# EAGLE design midi_module (EAGLE 9.0.0)

## Sheet 1 of 3
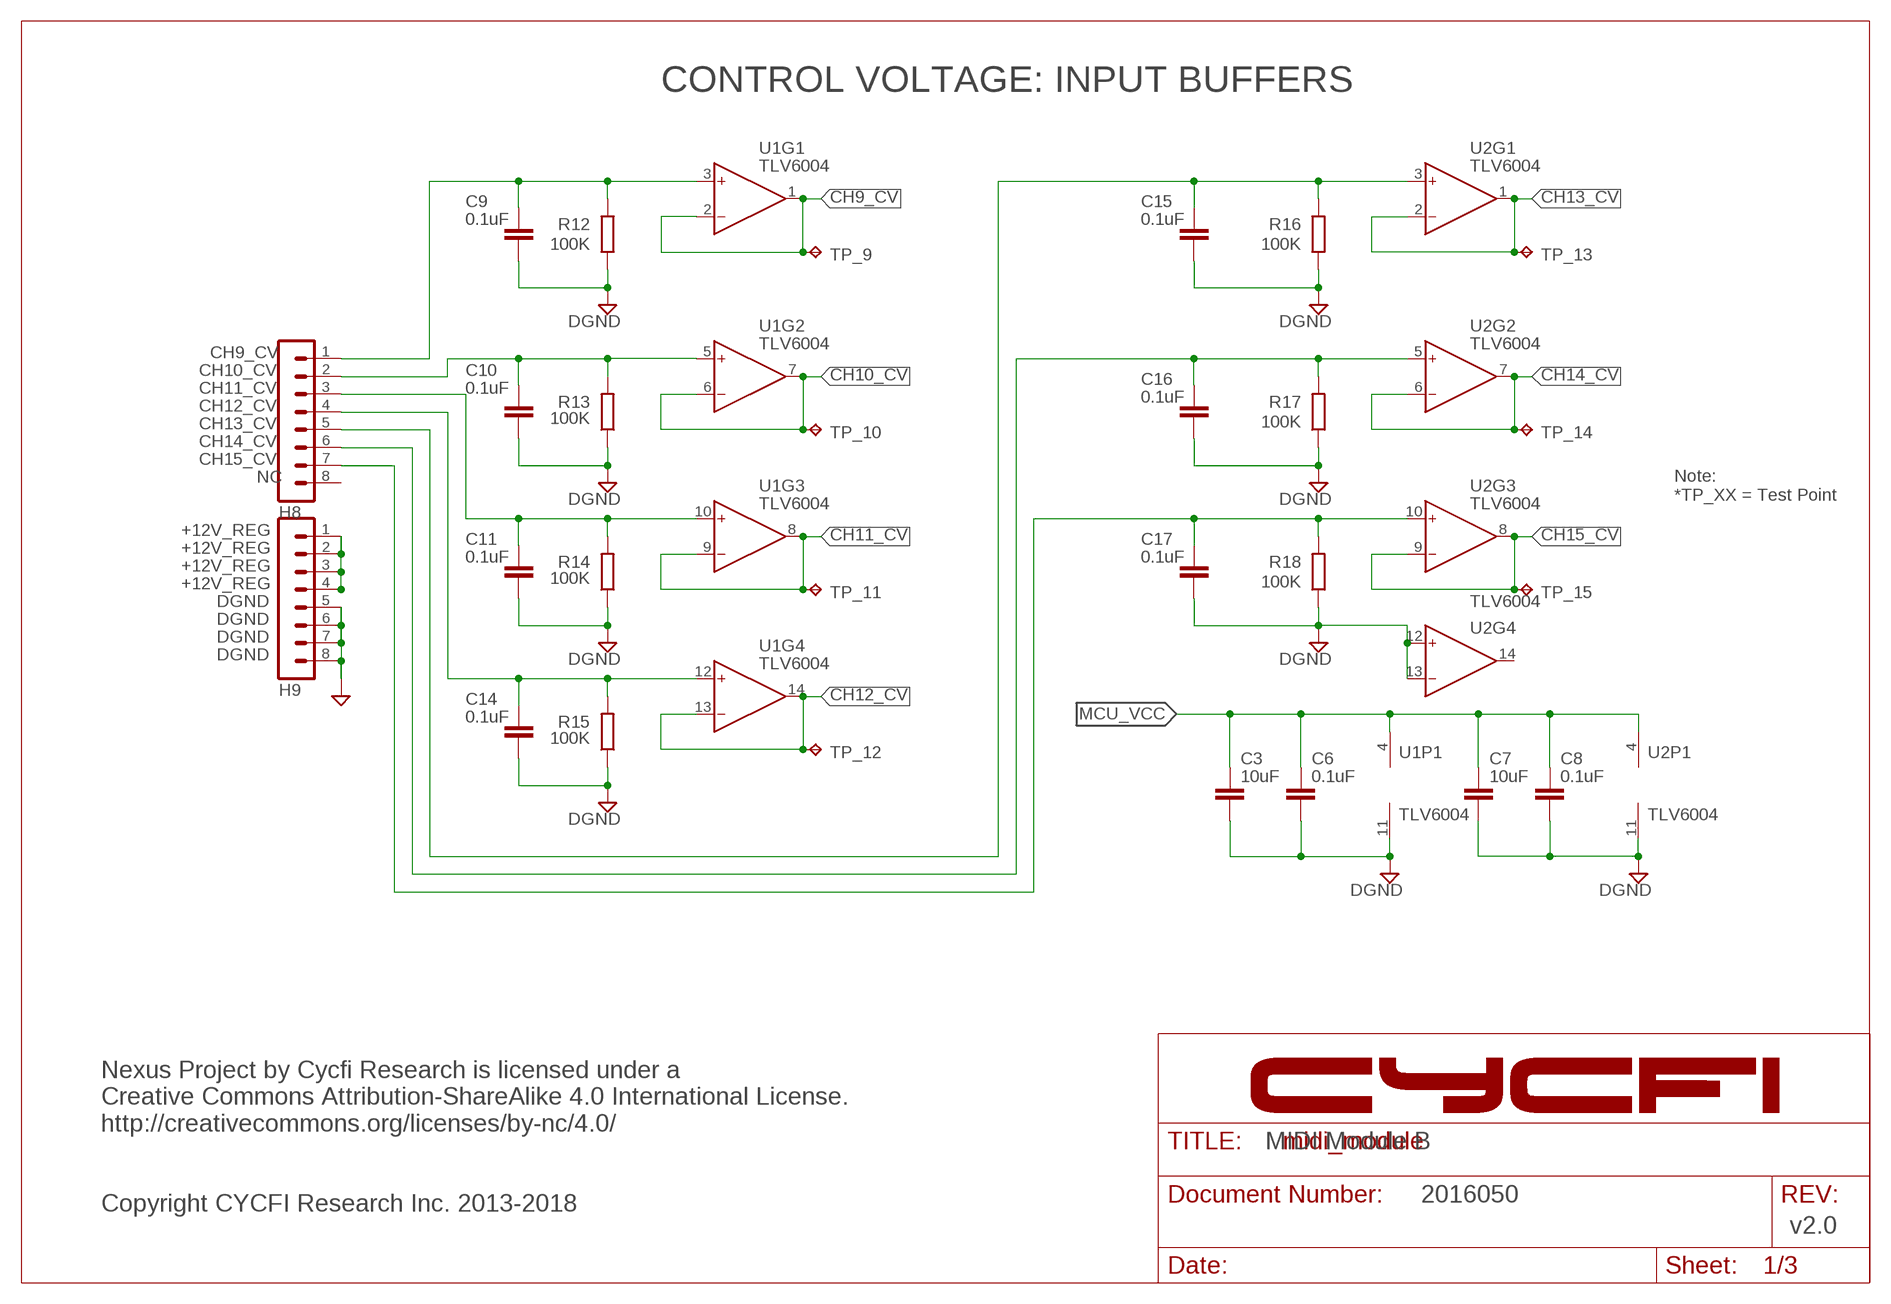
[diagram p0: schematic, sheet 1]

### Parts
C3  10uF  C-EUC0805  [C0805]
C6  0.1uF  C-EUC0603  [C0603]
C7  10uF  C-EUC0805  [C0805]
C8  0.1uF  C-EUC0603  [C0603]
C9  0.1uF  C-EUC0603  [C0603]
C10  0.1uF  C-EUC0603  [C0603]
C11  0.1uF  C-EUC0603  [C0603]
C14  0.1uF  C-EUC0603  [C0603]
C15  0.1uF  C-EUC0603  [C0603]
C16  0.1uF  C-EUC0603  [C0603]
C17  0.1uF  C-EUC0603  [C0603]
H8  MA08-1  [MA08-1]
H9  MA08-1  [MA08-1]
R12  100K  R-EU_R0402  [R0402]
R13  100K  R-EU_R0402  [R0402]
R14  100K  R-EU_R0402  [R0402]
R15  100K  R-EU_R0402  [R0402]
R16  100K  R-EU_R0402  [R0402]
R17  100K  R-EU_R0402  [R0402]
R18  100K  R-EU_R0402  [R0402]
TP_9  TPB1,27  [B1,27]
TP_10  TPB1,27  [B1,27]
TP_11  TPB1,27  [B1,27]
TP_12  TPB1,27  [B1,27]
TP_13  TPB1,27  [B1,27]
TP_14  TPB1,27  [B1,27]
TP_15  TPB1,27  [B1,27]
U1  TLV6004  [SSOP-14]
U2  TLV6004  [SSOP-14]

### Nets
+12V_REG: H9.1 H9.2 H9.3 H9.4 ; also sheet 3
CH9_CV: TP_9.TP U1.1(OUT) U1.2(IN-) ; also sheet 2
CH10_CV: TP_10.TP U1.6(IN-) U1.7(OUT) ; also sheet 2
CH11_CV: TP_11.TP U1.8(OUT) U1.9(IN-) ; also sheet 2
CH12_CV: TP_12.TP U1.13(IN-) U1.14(OUT) ; also sheet 2
CH13_CV: TP_13.TP U2.1(OUT) U2.2(IN-) ; also sheet 2
CH14_CV: TP_14.TP U2.6(IN-) U2.7(OUT) ; also sheet 2
CH15_CV: TP_15.TP U2.8(OUT) U2.9(IN-) ; also sheet 2
DGND: C3.2 C6.2 C7.2 C8.2 C9.2 C10.2 C11.2 C14.2 C15.2 C16.2 C17.2 H9.5 H9.6 H9.7 H9.8 R12.1 R13.1 R14.1 R15.1 R16.1 R17.1 R18.1 U1.11(P1:V-) U2.11(P1:V-) U2.12(IN+) U2.13(IN-) ; also sheet 2,3
MCU_VCC: C3.1 C6.1 C7.1 C8.1 U1.4(P1:V+) U2.4(P1:V+) ; also sheet 2,3
N$4: C9.1 H8.1 R12.2 U1.3(IN+)
N$10: C10.1 H8.2 R13.2 U1.5(IN+)
N$11: C11.1 H8.3 R14.2 U1.10(IN+)
N$14: C14.1 H8.4 R15.2 U1.12(IN+)
N$19: C15.1 H8.5 R16.2 U2.3(IN+)
N$20: C16.1 H8.6 R17.2 U2.5(IN+)
N$21: C17.1 H8.7 R18.2 U2.10(IN+)
Unconnected: H8.8 U2.14(OUT)

### Notes on the sheet
- CONTROL VOLTAGE: INPUT BUFFERS
- CH9_CV
- CH10_CV
- CH11_CV
- CH12_CV
- CH13_CV
- CH14_CV
- CH15_CV
- NC
- Note:
  *TP_XX = Test Point
- DGND
- DGND
- DGND
- MIDI Module B
- 2016050
- Nexus Project by Cycfi Research is licensed under a 
  Creative Commons Attribution-ShareAlike 4.0 International License.
  http://creativecommons.org/licenses/by-nc/4.0/
  
  
  Copyright CYCFI Research Inc. 2013-2018
- v2.0

## Sheet 2 of 3
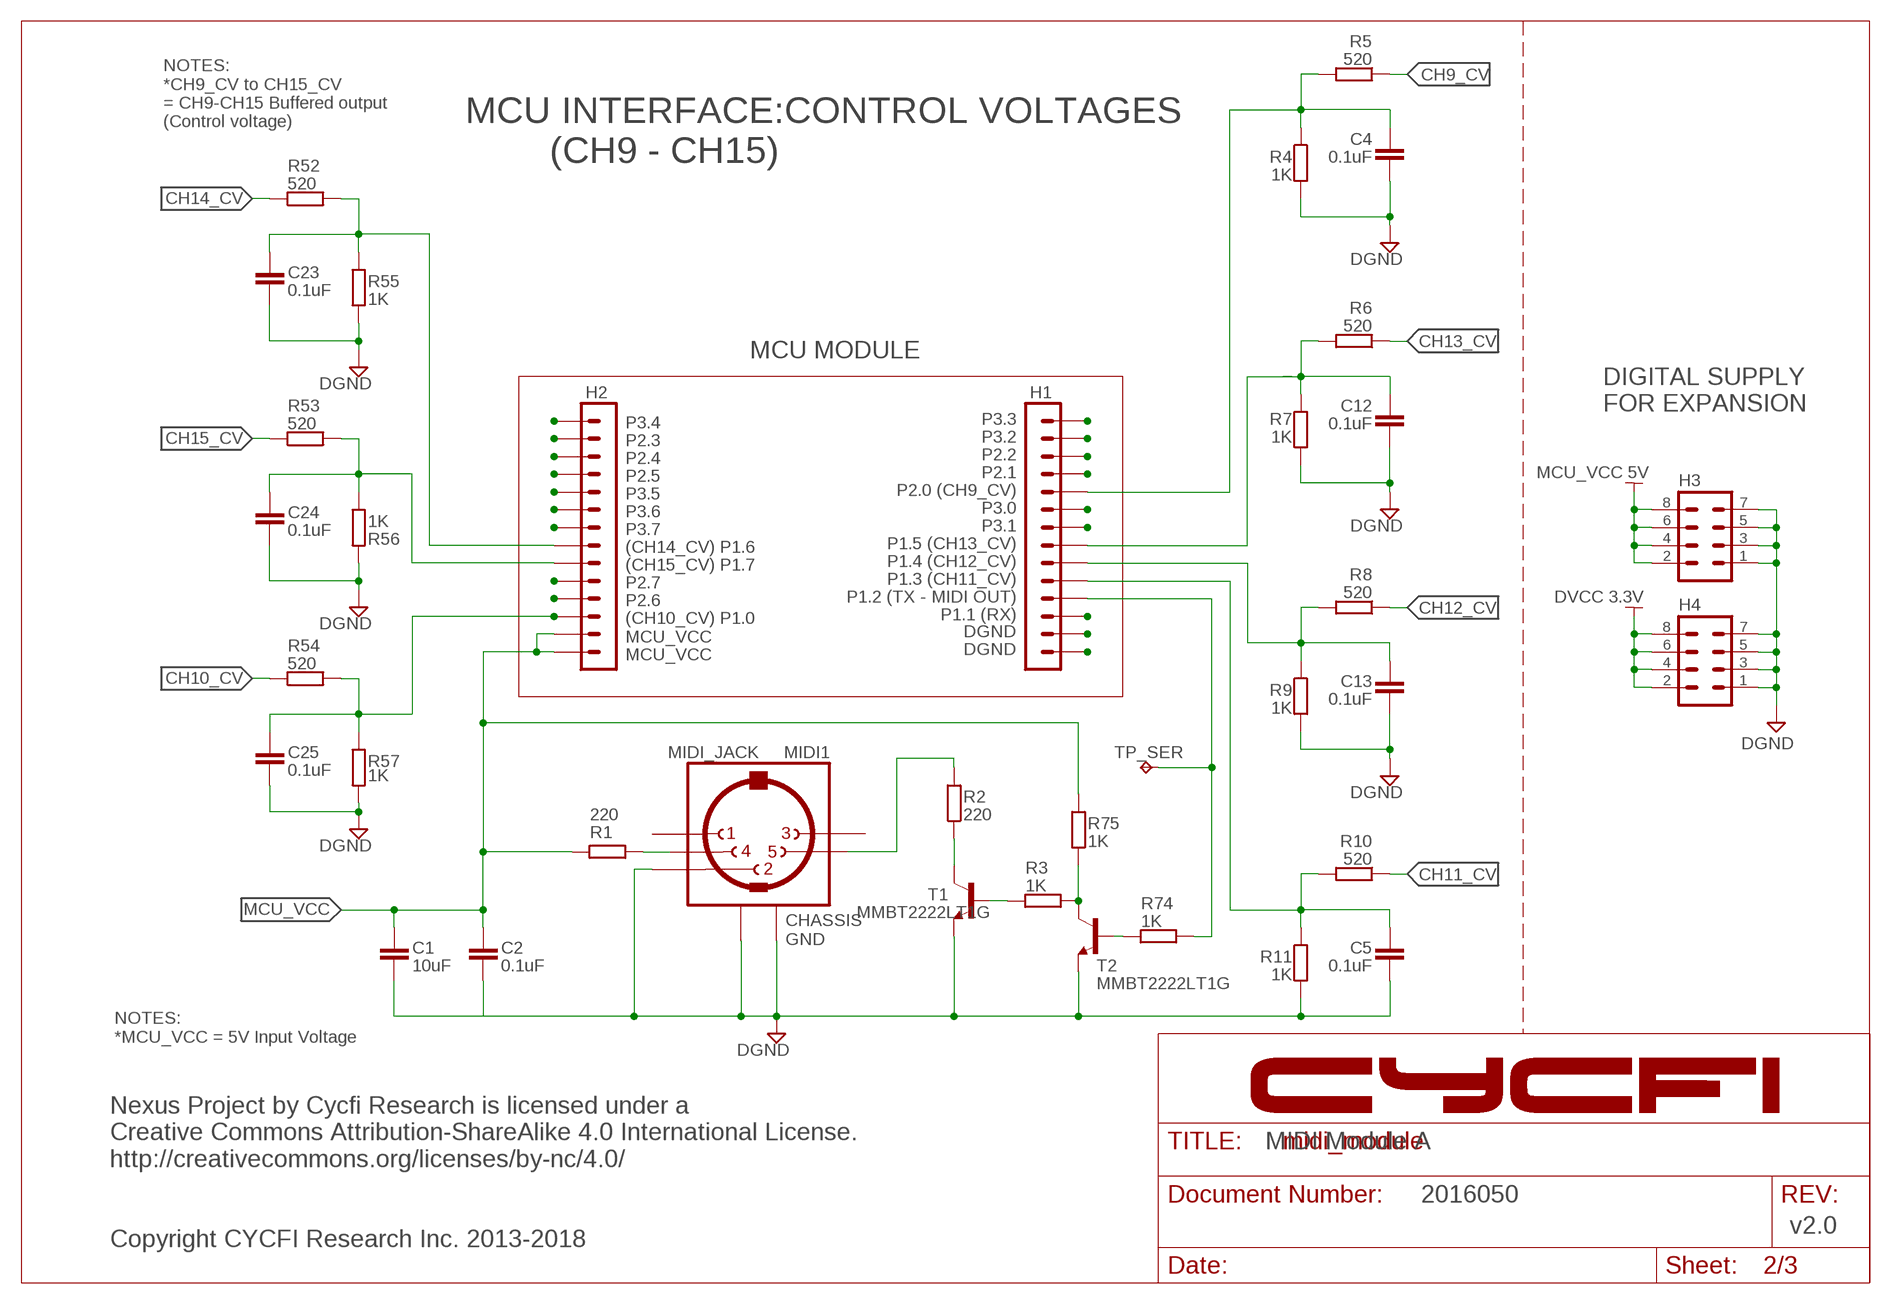
[diagram p1: schematic, sheet 2]

### Parts
C1  10uF  C-EUC0805  [C0805]
C2  0.1uF  C-EUC0603  [C0603]
C4  0.1uF  C-EUC0603  [C0603]
C5  0.1uF  C-EUC0603  [C0603]
C12  0.1uF  C-EUC0603  [C0603]
C13  0.1uF  C-EUC0603  [C0603]
C23  0.1uF  C-EUC0603  [C0603]
C24  0.1uF  C-EUC0603  [C0603]
C25  0.1uF  C-EUC0603  [C0603]
H1  14PIN-TH-2.54MM  [14P-TH-2.54MM]
H2  14PIN-TH-2.54MM  [14P-TH-2.54MM]
H3  MA04-2  [MA04-2]
H4  MA04-2  [MA04-2]
MIDI1  MIDI_JACK  [MIDI_JACK]
R1  220  R-EU_R0402  [R0402]
R2  220  R-EU_R0402  [R0402]
R3  1K  R-EU_R0402  [R0402]
R4  1K  R-EU_R0402  [R0402]
R5  520  R-EU_R0402  [R0402]
R6  520  R-EU_R0402  [R0402]
R7  1K  R-EU_R0402  [R0402]
R8  520  R-EU_R0402  [R0402]
R9  1K  R-EU_R0402  [R0402]
R10  520  R-EU_R0402  [R0402]
R11  1K  R-EU_R0402  [R0402]
R52  520  R-EU_R0402  [R0402]
R53  520  R-EU_R0402  [R0402]
R54  520  R-EU_R0402  [R0402]
R55  1K  R-EU_R0402  [R0402]
R56  1K  R-EU_R0402  [R0402]
R57  1K  R-EU_R0402  [R0402]
R74  1K  R-EU_R0402  [R0402]
R75  1K  R-EU_R0402  [R0402]
T1  MMBT2222LT1G  TRAN-MMBT2222A  [SOT23-3]
T2  MMBT2222LT1G  TRAN-MMBT2222A  [SOT23-3]
TP_SER  TPB1,27  [B1,27]

### Nets
CH9_CV: R5.1 ; also sheet 1
CH9D: C4.1 H1.10 R4.1 R5.2
CH10_CV: R54.1 ; also sheet 1
CH10A: C25.1 H2.12 R54.2 R57.1
CH11_CV: R10.1 ; also sheet 1
CH11A: C5.1 H1.5 R10.2 R11.1
CH12_CV: R8.1 ; also sheet 1
CH12A: C13.1 H1.6 R8.2 R9.1
CH13_CV: R6.1 ; also sheet 1
CH13A: C12.1 H1.7 R6.2 R7.1
CH14_CV: R52.1 ; also sheet 1
CH14A: C23.1 H2.8 R52.2 R55.1
CH15_CV: R53.1 ; also sheet 1
CH15A: C24.1 H2.9 R53.2 R56.1
DGND: C1.2 C2.2 C4.2 C5.2 C12.2 C13.2 C23.2 C24.2 C25.2 H1.1 H1.2 H3.1 H3.3 H3.5 H3.7 H4.1 H4.3 H4.5 H4.7 MIDI1.2 MIDI1.G1 MIDI1.G2 R4.2 R7.2 R9.2 R11.2 R55.2 R56.2 R57.2 T1.2(E) T2.2(E) ; also sheet 1,3
DVCC: H4.2 H4.4 H4.6 H4.8 ; also sheet 3
MCU_VCC: C1.1 C2.1 H2.13 H2.14 H3.2 H3.4 H3.6 H3.8 R1.2 R75.2 ; also sheet 1,3
MIDI_OUT: H1.4 R74.1 TP_SER.TP
N$1: MIDI1.5 R2.2
N$2: R2.1 T1.3(C)
N$3: R3.2 T1.1(B)
N$5: MIDI1.4 R1.1
N$6: H1.9
N$8: R74.2 T2.1(B)
N$9: R3.1 R75.1 T2.3(C)
P1.1: H1.3
P2.1: H1.11
P2.2: H1.12
P2.3: H2.2
P2.4: H2.3
P2.5: H2.4
P2.6: H2.11
P2.7: H2.10
P3.1: H1.8
P3.2: H1.13
P3.3: H1.14
P3.4: H2.1
P3.5: H2.5
P3.6: H2.6
P3.7: H2.7
Unconnected: MIDI1.1 MIDI1.3

### Notes on the sheet
- NOTES:
  *CH9_CV to CH15_CV 
  = CH9-CH15 Buffered output 
  (Control voltage)
- MCU INTERFACE:CONTROL VOLTAGES
          (CH9 - CH15)
- MCU MODULE
- DIGITAL SUPPLY
  FOR EXPANSION
- P3.4
- P3.3
- P2.3
- P3.2
- P2.4
- P2.2
- P2.5
- P2.1 | MCU_VCC 5V
- P3.5
- P2.0 (CH9_CV)
- P3.6
- P3.0
- P3.7
- P3.1
- (CH14_CV) P1.6
- P1.5 (CH13_CV)
- (CH15_CV) P1.7
- P1.4 (CH12_CV)
- P2.7
- P1.3 (CH11_CV)
- P2.6
- P1.2 (TX - MIDI OUT) | DVCC 3.3V
- (CH10_CV) P1.0
- P1.1 (RX)
- CHASSIS 
  GND
- NOTES:
  *MCU_VCC = 5V Input Voltage
- MIDI Module A
- 2016050
- v2.0
- Nexus Project by Cycfi Research is licensed under a
  Creative Commons Attribution-ShareAlike 4.0 International License.
  http://creativecommons.org/licenses/by-nc/4.0/
  
  
  Copyright CYCFI Research Inc. 2013-2018

## Sheet 3 of 3
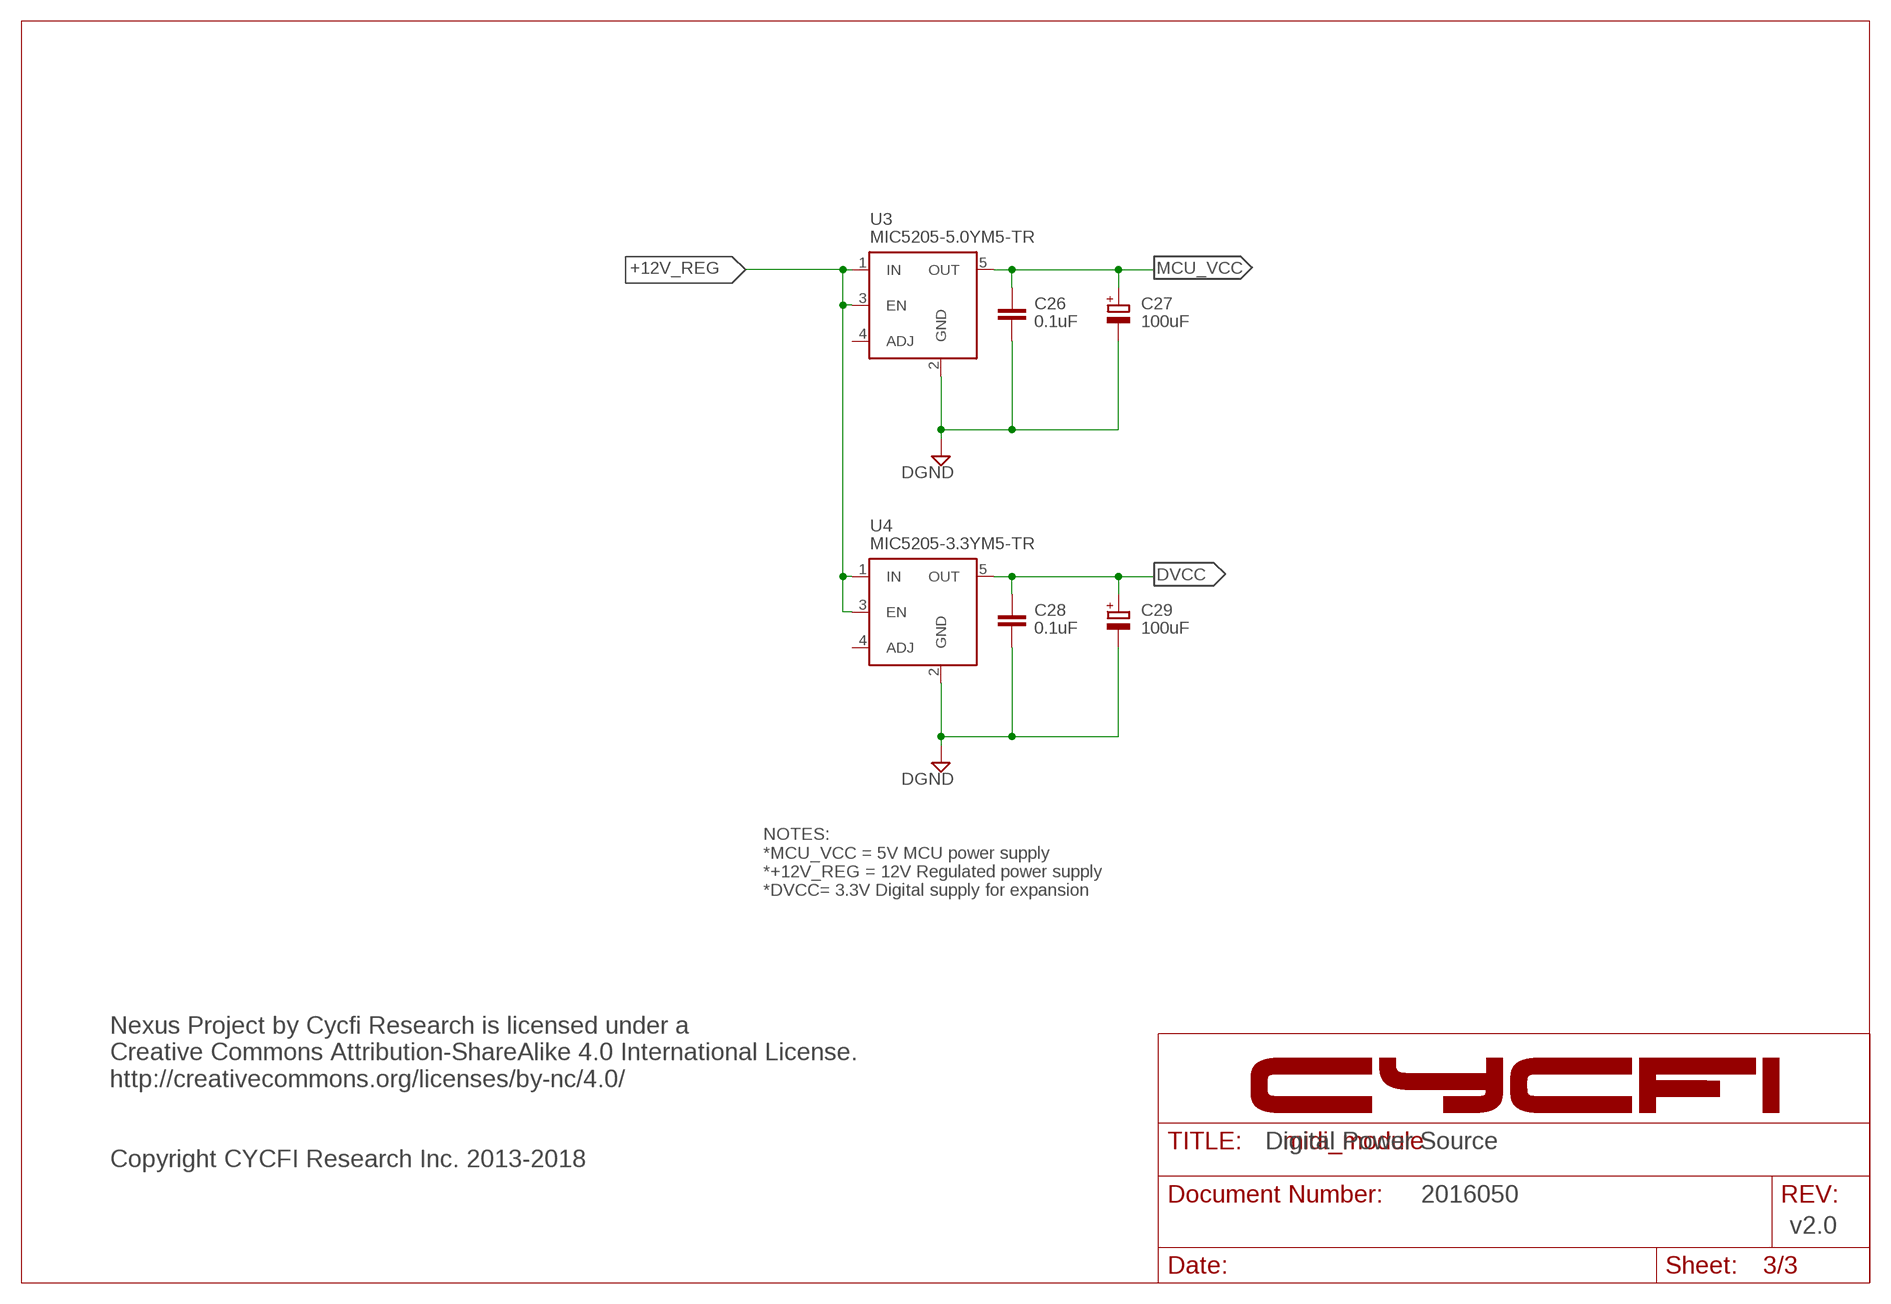
[diagram p2: schematic, sheet 3]

### Parts
C26  0.1uF  C-EUC0603  [C0603]
C27  100uF  CPOL-EU153CLV-0505  [153CLV-0505]
C28  0.1uF  C-EUC0603  [C0603]
C29  100uF  CPOL-EU153CLV-0505  [153CLV-0505]
U3  MIC5205-5.0YM5-TR  MIC5219BM5  [SOT23-5]
U4  MIC5205-3.3YM5-TR  MIC5219BM5  [SOT23-5]

### Nets
+12V_REG: U3.1(IN) U3.3(EN) U4.1(IN) U4.3(EN) ; also sheet 1
DGND: C26.2 C27.- C28.2 C29.- U3.2(GND) U4.2(GND) ; also sheet 1,2
DVCC: C28.1 C29.+ U4.5(OUT) ; also sheet 2
MCU_VCC: C26.1 C27.+ U3.5(OUT) ; also sheet 1,2
Unconnected: U3.4(ADJ) U4.4(ADJ)

### Notes on the sheet
- NOTES:
  *MCU_VCC = 5V MCU power supply
  *+12V_REG = 12V Regulated power supply
  *DVCC= 3.3V Digital supply for expansion
- Digital Power Source
- Nexus Project by Cycfi Research is licensed under a 
  Creative Commons Attribution-ShareAlike 4.0 International License.
  http://creativecommons.org/licenses/by-nc/4.0/
  
  
  Copyright CYCFI Research Inc. 2013-2018
- 2016050
- v2.0

## Library data of the parts
C1-C17 C23-C26 C28 = resistor:C-EU: CAPACITOR, European symbol
C27 C29 = resistor:CPOL-EU: POLARIZED CAPACITOR, European symbol
H1 H2 = CYCFI_Con:14PIN-TH-2.54MM
H3 H4 = con-lstb:MA04-2: PIN HEADER; OC_FARNELL: unknown; OC_NEWARK: unknown
H8 H9 = con-lstb:MA08-1: PIN HEADER; OC_FARNELL: unknown; OC_NEWARK: unknown
MIDI1 = CYCFI_Con:MIDI_JACK
R1-R18 R52-R57 R74 R75 = resistor:R-EU_: RESISTOR, European symbol
T1 T2 = Cycfi:TRAN-MMBT2222A
TP_9-TP_15 TP_SER = testpad:TP: Test pad
U1 U2 = CYCFI_semicon:TLV6004
U3 U4 = v-reg-micrel:MIC5219BM5: VOLTAGE REGULATOR; MF: ALTERA CORPORATION; MPN: MIC5219BM5 TR; OC_FARNELL: 1100656; OC_NEWARK: 09J8939

## Board
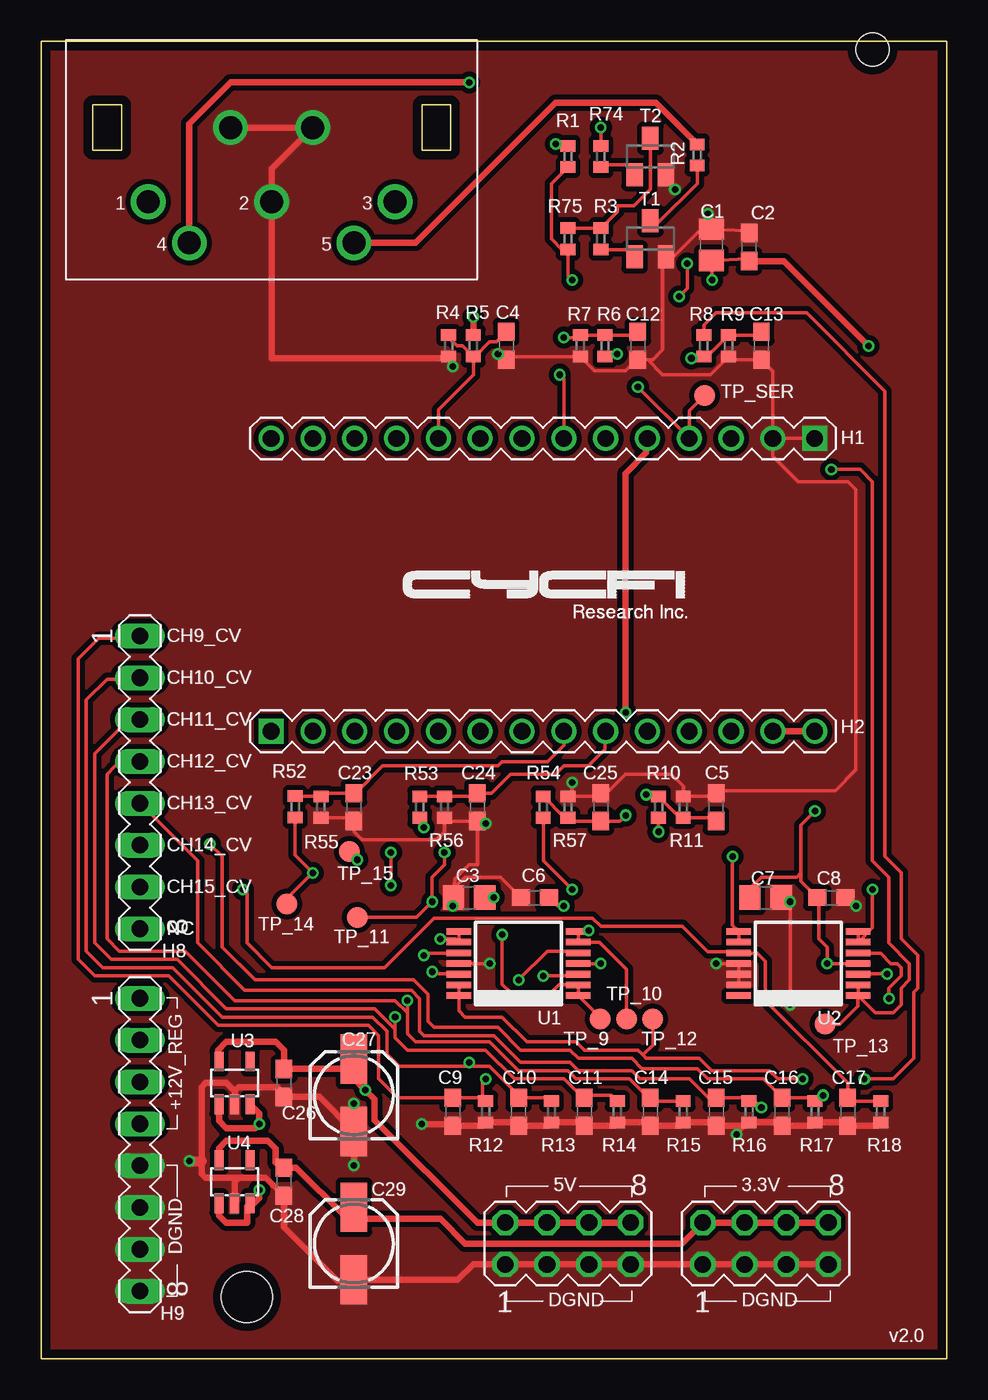
[diagram p3: board, top side]
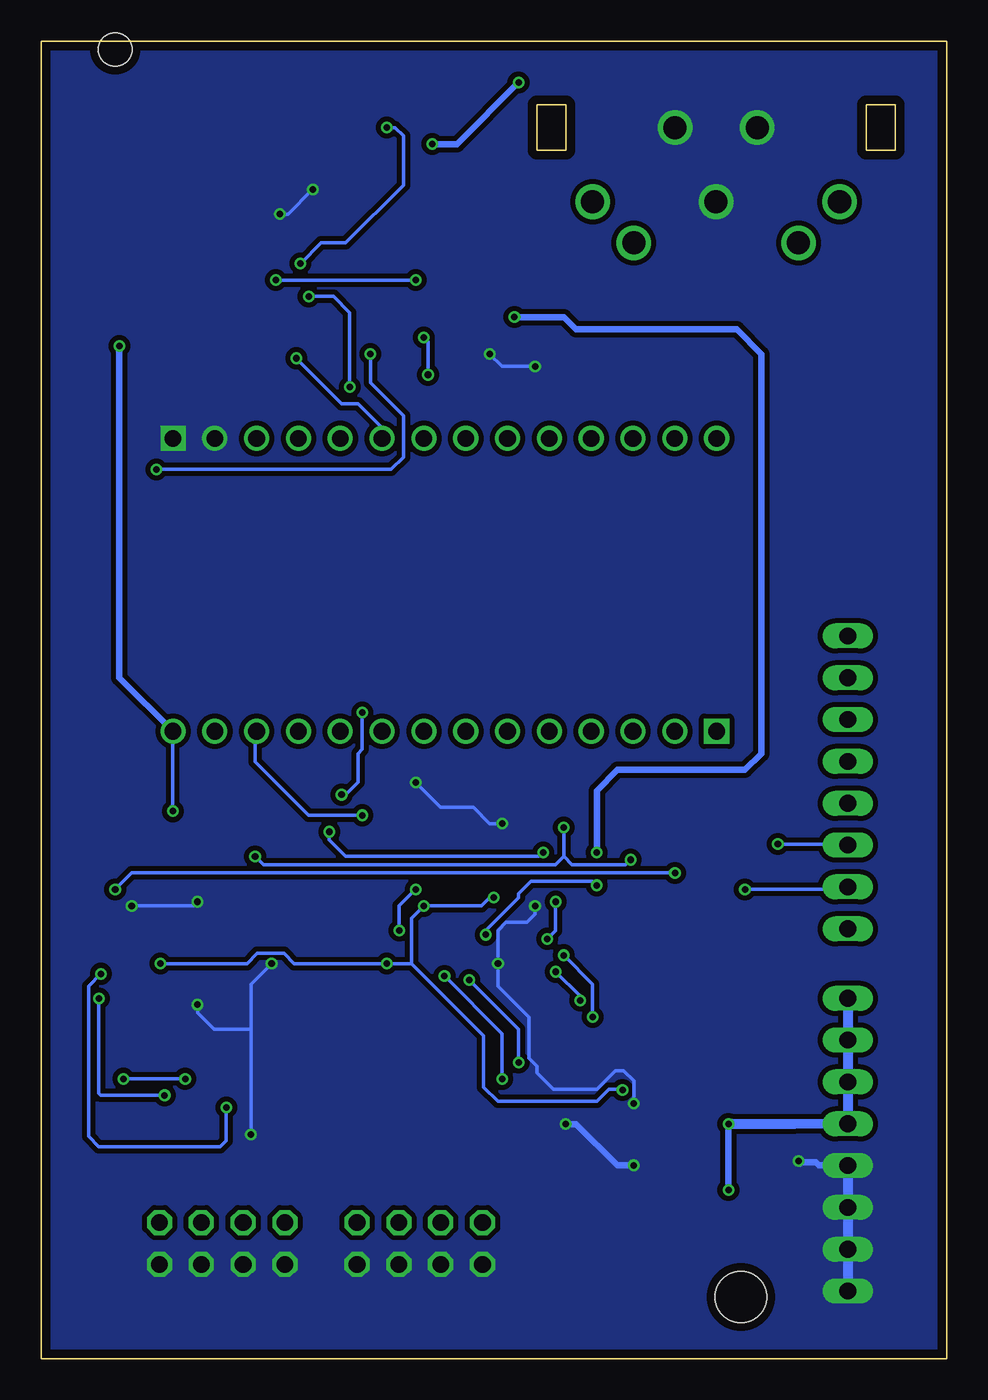
[diagram p4: board, bottom side, seen from below]

Size 55 x 80 mm. Coordinates in mm from the lower left corner, seen from the top.
Outline: 0,0 55,0 55,80 0,80 0,0
Copper layers (1*16): Top 0.035mm / dielectric 1.6mm / Bottom 0.035mm
Design rules "Elecrow_2-layer_PCB_eagle_rule": minimum track width 6mil, minimum drill 12mil, track to track 6mil, track to pad 8mil, pad to pad 12mil, via to via 12mil, smd to smd 0mil, copper to edge 20mil, drill to drill 10mil, minimum pad ring 6mil, minimum via ring 6mil, stop-mask expansion 0mil, vias tented up to drill 100mil, thermal gap 10mil
Holes 3.1 mm at 12.5,3.75
Holes 2 mm at 50.5,79.5

### Footprints (pad centres in the part's own frame; a part is rotated, then mirrored left to right if it is on the bottom)
C0805 = smd 1.3 x 1.5: 1 -0.95,0; 2 0.95,0
C0603 = smd 1.1 x 1: 1 -0.85,0; 2 0.85,0
153CLV-0505 = smd 3 x 1.6: + 2.2,0; - -2.2,0
14P-TH-2.54MM = drill 1.016 square: 1 -16.51,0 | drill 1.016: 2 -13.97,0; 3 -11.43,0; 4 -8.89,0; 5 -6.35,0; 6 -3.81,0; 7 -1.27,0; 8 1.27,0; 9 3.81,0; 10 6.35,0; 11 8.89,0; 12 11.43,0; 13 13.97,0; 14 16.51,0
MA04-2 = drill 1.016 octagon: 1 -3.81,-1.27; 2 -3.81,1.27; 3 -1.27,-1.27; 4 -1.27,1.27; 5 1.27,-1.27; 6 1.27,1.27; 7 3.81,-1.27; 8 3.81,1.27
MA08-1 = drill 1.016 long: 1 -8.89,0; 2 -6.35,0; 3 -3.81,0; 4 -1.27,0; 5 1.27,0; 6 3.81,0; 7 6.35,0; 8 8.89,0
MIDI_JACK = drill 1.4: 1 -7.5,0; 2 0,0; 3 7.5,0; 4 -5,-2.5; 5 5,-2.5; G1 -2.5,4.5; G2 2.5,4.5
R0402 = smd 0.7 x 0.9: 1 -0.65,0; 2 0.65,0
SOT23-3 = smd 1 x 1.4: 1 -0.95,-1.1; 2 0.95,-1.1; 3 0,1.1
B1,27 = smd 1.27 x 1.27: TP 0,0
SSOP-14 = smd 0.4 x 1.5: 1 -1.95,-3.625; 2 -1.3,-3.625; 3 -0.65,-3.625; 4 0,-3.625; 5 0.65,-3.625; 6 1.3,-3.625; 7 1.95,-3.625; 8 1.95,3.625; 9 1.3,3.625; 10 0.65,3.625; 11 0,3.625; 12 -0.65,3.625; 13 -1.3,3.625; 14 -1.95,3.625
SOT23-5 = smd 0.55 x 1.2: 1 -0.95,-1.3; 2 0,-1.3; 3 0.95,-1.3; 4 0.95,1.3; 5 -0.95,1.3

### Placement (x,y rotation side)
C1  40.71,67.63 90 top
C2  43,67.5 90 top
C3  26,28 180 top
C4  28.25,61.5 270 top
C5  41,33.5 90 top
C6  30,28 180 top
C7  44,28 0 top
C8  48,28 0 top
C9  25,15 270 top
C10  29,15 270 top
C11  33,15 270 top
C12  36.25,61.5 270 top
C13  43.75,61.5 270 top
C14  37,15 270 top
C15  41,15 270 top
C16  45,15 270 top
C17  49,15 270 top
C23  19,33.5 270 top
C24  26.5,33.5 270 top
C25  34,33.5 90 top
C26  14.75,16.75 270 top
C27  19,16 90 top
C28  14.75,10.75 270 top
C29  19,7 90 top
H1  30.48,55.88 180 top
H2  30.48,38.1 0 top
H3  32,7 0 top
H4  44,7 0 top
H8  6,35 270 top
H9  6,13 270 top
MIDI1  14,70.25 0 top
R1  32,73 270 top
R2  39.85,73.09 90 top
R3  34,68 270 top
R4  24.75,61.5 270 top
R5  26.25,61.5 270 top
R6  34.25,61.5 90 top
R7  32.75,61.5 270 top
R8  40.25,61.5 270 top
R9  41.75,61.5 270 top
R10  37.5,33.5 90 top
R11  39,33.5 90 top
R12  27,15 90 top
R13  31,15 90 top
R14  35,15 90 top
R15  39,15 90 top
R16  43,15 90 top
R17  47,15 90 top
R18  51,15 90 top
R52  15.43,33.51 90 top
R53  23,33.5 90 top
R54  30.5,33.5 90 top
R55  17,33.5 270 top
R56  24.5,33.5 270 top
R57  32,33.5 90 top
R74  34,73 270 top
R75  32,68 270 top
T1  37,68 0 top
T2  37,73 0 top
TP_9  33.97,20.64 0 top
TP_10  35.56,20.64 0 top
TP_11  19.2,26.8 0 top
TP_12  37.15,20.64 0 top
TP_13  47.62,20.32 0 top
TP_14  14.92,27.62 0 top
TP_15  18.73,30.8 0 top
TP_SER  40.3,58.5 0 top
U1  29,24 90 top
U2  46,24 90 top
U3  11.75,16.75 0 top
U4  11.75,10.75 0 top

### Tracks (layer width: path | path; a pad name or v marks a point on that pad's centre or on a via)
+12V_REG  (via drill 0.4)
  Top 0.406: U4.1 10.8,8.7 11.25,8.25 12.5,8.25 12.5,9.25 U4.3 12.95,9.45 13.25,9.75 v13.25,10.25 | U3.3 13.25,14.9 v13.25,14.25 13,14 11.25,14 10.8,14.45 U3.1
  Bottom 0.406: v13.25,10.25 v13.25,14.25
  Bottom 0.61: H9.1 H9.2 H9.3 H9.4 6.73,14.27 9.25,14.25 v13.25,14.25
CH9_CV  (via drill 0.4)
  Top 0.203: v28,25.75 28,22.75 28.5,22.25 31,22.25 31.45,22.7 U1.2 U1.1 33.97,20.7 TP_9.TP | v21.25,28.75 v21.25,30.75
  Top 0.406: v26.25,63.25 R5.1
  Bottom 0.203: v28,25.75 28,26 26,28 26,28.25 25.25,29 21.5,29 v21.25,28.75
  Bottom 0.406: v21.25,30.75 21.25,34.5 20,35.75 12.25,35.75 11.25,36.75 11.25,61 12.75,62.5 22.5,62.5 23.25,63.25 v26.25,63.25
CH9D
  Top 0.203: R4.1 24.75,62 25.25,61.5 25.6,61.5 R5.2 | R5.2 26.35,60.85 27.25,61.75 27.65,61.75 C4.1 | R5.2 26.25,59.75 24.13,57.63 H1.10
CH10_CV  (via drill 0.4)
  Top 0.203: v33.25,26 33.2,25.95 U1.7 U1.6 33.9,25.3 35.56,23.64 TP_10.TP | v32.25,28.5 30.5,30.25 R54.1
  Bottom 0.203: v33.25,26 33.25,27.5 v32.25,28.5
CH10A  (via drill 0.4)
  Top 0.203: R54.2 31.8,32.85 R57.1 32.2,32.65 C25.1 35.15,32.65 v35.5,33
  Bottom 0.203: v35.5,33 38.75,33 42,36.25 42,38.01 H2.12
CH11_CV  (via drill 0.4)
  Top 0.203: U1.8 U1.9 25.18,25.5 v24.25,25.5 | R10.1 v37.5,32 | v24.5,30.75 24.5,30 23.75,29.25 v23.75,27.75 22.8,26.8 TP_11.TP
  Bottom 0.203: v37.5,32 37.5,31.5 36.5,30.5 24.75,30.5 v24.5,30.75 | v23.75,27.75 23.75,26 v24.25,25.5
CH11A  (via drill 0.4)
  Top 0.203: C5.1 40.8,32.85 R11.1 38.8,32.85 R10.2 36.85,34.15 v36.75,34.25
  Top 0.406: v35.5,39.25 35.5,53.75 36.75,55 36.75,55.8 H1.5
  Bottom 0.203: v36.75,34.25 36.5,34.25 35.75,35 35.75,36.75 35.5,37 v35.5,39.25
CH12_CV  (via drill 0.4)
  Top 0.203: U1.14 U1.13 25.38,21.12 25.75,20.75 28,20.75 29.5,19.25 32.5,19.25 33,18.75 36.25,18.75 36.55,18.45 | R8.1 40.25,62.75 41,63.5 46.5,63.5 51.25,58.75 51.25,30.5 52.25,29.5 52.25,25.5 53.25,24.5 53.25,22.5 53,22.25 53,18.25 51.75,17 v50,17 | 36.55,18.45 36.75,18.25 40,18.25 40.75,17.5 44.25,17.5 44.75,17 v46.25,17 | TP_12.TP 37.15,19.05 36.55,18.45
  Bottom 0.203: v46.25,17 v50,17
CH12A  (via drill 0.4)
  Top 0.203: C13.1 43.55,62.15 R9.1 40.45,60.85 R8.2 39.6,60.85 v39.5,60.75
  Bottom 0.203: v39.5,60.75 36.75,58 35.75,58 34.25,56.5 34.25,55.92 H1.6
CH13_CV  (via drill 0.4)
  Top 0.203: U2.1 U2.2 | U2.1 50.67,21 51.75,21 52.25,21.5 52.25,22.5 52.75,23 52.75,24 51.5,25.25 51.5,29.25 50.5,30.25 50.5,53.25 49.75,54 v48,54 | v35,61 34.4,61 R6.1 | TP_13.TP 48.52,20.32 49.6,21.4 49.6,22.02 U2.1
  Bottom 0.203: v35,61 35,59.25 33,57.25 33,54.75 33.75,54 v48,54
CH13A  (via drill 0.4)
  Top 0.203: C12.1 36.05,62.15 R6.2 R7.1 32.6,62 v31.75,62 | H1.7 31.75,59.5 v31.5,59.75
  Bottom 0.203: v31.5,59.75 31.5,61.75 v31.75,62
CH14_CV  (via drill 0.4)
  Top 0.203: U2.7 U2.6 50.5,26.18 v50.5,28.5 | R52.1 15.43,30.57 v16.5,29.5 14.92,27.92 TP_14.TP
  Bottom 0.203: v16.5,29.5 49.5,29.5 v50.5,28.5
CH14A
  Top 0.203: R52.2 R55.1 17.2,34.35 C23.1 19.1,34.35 20.75,36 27.75,36 28,36.25 30.75,36.25 31.75,37.25 H2.8
CH15_CV  (via drill 0.4)
  Top 0.203: R53.1 23,32.5 v23.25,32.25 | v42,30.5 42,26.32 U2.8 U2.9 | TP_15.TP 18.73,30.77 v19.2,30.3
  Bottom 0.203: v23.25,32.25 23.25,30.5 | 23.25,30.5 23.75,30 41.5,30 v42,30.5 | v19.2,30.3 19.5,30 22.75,30 23.25,30.5
CH15A
  Top 0.203: R53.2 R56.1 26.3,34.15 C24.1 27.35,34.35 28.5,35.5 31.25,35.5 31.75,36 33.25,36 34.25,37 34.25,38.06 H2.9
DGND  (via drill 0.4)
  Top 0.203: R16.1 42.98,14.35 v42.25,13.62 | v41,24 U2.11 U2.13 U2.12 | U1.11 v27.25,24 | v19,15.5 C27.- | C1.2 40.71,69.29 v40.5,69.5 | v38.5,71 38,71.5 38,71.85 T2.2 | C1.2 40.69,68.5 40,68.5 38.4,66.9 T1.2 37.75,66.7 37.75,61.25 37.15,60.65 36.85,60.65 | C1.2 42.87,68.48 C2.2 | R55.2 18.8,32.85 C23.2 19,32 19.5,31.5 24,31.5 24.5,32 R56.2 24.7,32.65 C24.2 | C3.2 25.15,28.65 25.75,29.25 27.9,29.25 C6.2 | C3.2 25.15,29.15 26,30 26.5,30 C24.2 | v49.5,27.5 49.5,27.75 49.1,27.75 C8.2 | C3.2 25.15,27.65 v25,27.5 | C24.2 26.85,32.65 v27,32.5 | v32.25,35 32.25,34.4 R57.2 33.8,34.15 C25.2 34.35,34.35 35.5,35.5 38.25,35.5 39,34.75 R11.2 40.8,34.15 C5.2 41.15,34.5 48.25,34.5 49.5,35.75 49.5,52.75 49,53.25 46,53.25 44.45,54.8 H1.2 | v27.75,61 28.1,60.65 C4.2 28.45,60.85 R7.2 33.6,60 35.5,60 36.15,60.65 C12.2 36.85,60.65 | v25,60.25 25,60.6 R4.2 | 36.85,60.65 37.75,59.75 40.65,59.75 R9.2 41.95,60.65 C13.2 44.45,59.95 H1.2 | H1.1 H1.2 | C7.2 45.25,28 v45.5,27.75 v45.5,21.5
  Top 0.406: U4.2 11.75,10.75 12,11 | H4.7 H4.5 H4.3 H4.1 H3.7 H3.5 H3.3 H3.1 28.17,5.75 26.25,5.75 25.3,4.8 C29.- 18.95,4.75 18,4.75 14.75,8 C28.2 13.65,11 12,11 | U3.2 11.75,16.25 | 11.75,16.25 12,16.5 14.35,16.5 C26.2 16.9,15.9 C27.- v19,11.75 | 11.75,16.25 11.25,16.75 10,16.75 9.75,16.5 9.75,12 9.75,11.25 10,11 12,11 | v23.12,14.25 24.9,14.25 C9.2 26.8,14.15 R12.1 28.8,14.35 C10.2 30.8,14.15 R13.1 32.8,14.35 C11.2 34.8,14.15 R14.1 36.8,14.35 C14.2 38.8,14.15 R15.1 40.8,14.35 C15.2 42.8,14.15 R16.1 44.8,14.35 C16.2 46.8,14.15 R17.1 48.8,14.35 C17.2 50.8,14.15 R18.1 | MIDI1.G1 MIDI1.G2 14,72.25 MIDI1.2 14,60.75 24.65,60.75 R4.2
  Top 0.61: v9,12 9.75,12
  Bottom 0.203: v42.25,13.62 42.25,20 | 42.25,20 42.25,22.75 v41,24 | v19,15.5 19,16.88 19.62,17.5 20.12,17.5 21.25,16.38 23.88,16.38 24.88,17.38 24.88,17.75 25.38,18.25 25.38,20.75 27.25,22.62 v27.25,24 27.25,26 26.75,26.5 25.5,26.5 25,27 v25,27.5 | v40.5,69.5 40,69.5 v38.5,71 | v45.5,27.75 45.75,27.5 v49.5,27.5 | v27,32.5 27.75,32.5 28.75,33.5 30.75,33.5 v32.25,35 | v27.75,61 27,60.25 v25,60.25 | v45.5,21.5 45.5,21 44.5,20 42.25,20
  Bottom 0.406: v19,11.75 20,11.75 22.5,14.25 v23.12,14.25 | 8.94,11.94 7.94,11.94 7.75,11.75 6.02,11.75 H9.5
  Bottom 0.61: H9.5 H9.6 H9.7 H9.8 | 8.94,11.94 v9,12
  pour Bottom (isolate 0.305, no thermals): 0,0 55,0 55,80 0,80
  pour Top (isolate 0.305, no thermals): 0.1,0 54.9,0 55,0 55,80 0,80 0,0
DVCC
  Top 0.406: 10.8,11.94 U4.5 10.8,12.8 11.25,13.25 13.75,13.25 14.25,12.75 14.25,11.9 C28.1 15.5,11.6 18.45,8.65 C29.+ 19,8.5 24.25,8.5 25.75,7 38.92,7 H4.2 H4.4 H4.6 H4.8
MCU_VCC  (via drill 0.4)
  Top 0.203: U2.4 v47.75,24 47.75,25 47.25,25.5 47.25,27.9 C8.1 46.15,29 46.15,29.5 | U1.4 v34,24 | R1.2 31,71.35 31,68 31.65,67.35 R75.2 32,65.75 v32.25,65.5 | C2.1 42.87,66.78 C1.1 40.75,66.74 v40.75,65.5 | C7.1 43.15,28.65 43.75,29.25 45.9,29.25 46.15,29.5 | C3.1 v27.5,28 | v31.75,27.5 31.35,27.5 C6.1 | 46.15,29.5 46.15,32.4 v47,33.25
  Top 0.406: H3.8 H3.6 H3.4 H3.2 28.17,8.25 26.5,8.25 20.25,14.5 20.25,15.75 v19.69,16.31 19,17 C27.+ 18.4,17.6 C26.1 14.75,18.75 14.25,19.25 11.25,19.25 10.75,18.75 10.75,18.1 U3.5 | H2.14 H2.13 | C2.1 45.1,66.65 v50.25,61.5
  Bottom 0.203: v47.75,24 42.5,24 41.88,24.62 40.25,24.62 39.62,24 v34,24 32.5,24 | 32.5,24 28.12,19.62 28.12,16.5 27.25,15.62 21.25,15.62 20.5,16.38 19.75,16.38 v19.69,16.31 | v27.5,28 27.75,28 28.25,27.5 v31.75,27.5 32.5,26.75 32.5,24 | v47,33.25 H2.14 | v32.25,65.5 v40.75,65.5
  Bottom 0.406: v50.25,61.5 50.25,41.36 H2.14
MIDI_OUT  (via drill 0.4)
  Top 0.203: R74.1 v34,74.75 | v39.25,66.5 39.25,65 v38.75,64.5 | v36.25,59 H1.4 39.37,57.57 TP_SER.TP
  Bottom 0.203: v34,74.75 33.5,74.75 33,74.25 33,71.25 36.5,67.75 38,67.75 v39.25,66.5 | v38.75,64.5 37.25,64.5 36.25,63.5 v36.25,59
N$1
  Top 0.406: R2.2 37.34,76.25 31.25,76.25 22.75,67.75 MIDI1.5
N$2
  Top 0.203: R2.1 39.85,71.35 37.5,69 37.1,69 T1.3
N$3
  Top 0.203: R3.2 35.6,67.35 T1.1
N$4  (via drill 0.4)
  Top 0.203: 26.8,15.85 C9.1 21.65,15.85 20.5,17 20.5,19.62 19.88,20.25 10.75,20.25 7.75,23.25 3.25,23.25 2.25,24.25 2.25,42.5 3.5,43.75 5.86,43.75 H8.1 | 26.8,15.85 R12.2 | 26.8,15.85 26.8,16.8 v27,17 | v30.5,23.25 32.52,23.25 U1.3
  Bottom 0.203: v27,17 27,19.75 v30.5,23.25
N$5  (via drill 0.4)
  Top 0.406: R1.1 31.35,73.65 v31.25,73.75 | v26,77.5 11.5,77.5 9,75 MIDI1.4
  Bottom 0.406: v31.25,73.75 29.75,73.75 v26,77.5
N$8
  Top 0.203: T2.1 36.05,71.95 35.5,72.5 34.15,72.5 R74.2
N$9
  Top 0.203: T2.3 37,71 36,70 35,70 35,69.65 R3.1 R75.1
N$10  (via drill 0.4)
  Top 0.203: 26.25,17.75 21.75,17.75 21,18.5 21,19.88 20.12,20.75 11,20.75 8,23.75 3.75,23.75 2.75,24.75 2.75,40 4,41.25 5.9,41.25 H8.2 | R13.2 30.8,15.85 C10.1 29,16 27.25,17.75 26.25,17.75 | 26.25,17.75 v26,18 | v29,23 30.75,24.75 32.52,24.75 U1.5
  Bottom 0.203: v26,18 26,20 v29,23
N$11  (via drill 0.4)
  Top 0.203: R14.2 34.65,16 33,16 C11.1 32.9,15.85 31.75,17 28.75,17 27,18.75 22.25,18.75 21.5,19.5 21.5,20 | 21.5,20 20.25,21.25 11.25,21.25 8.25,24.25 4.25,24.25 3.25,25.25 3.25,36.75 5.25,38.75 5.94,38.75 H8.3 | 21.5,20 v21.5,20.75 | U1.10 25.35,24.62 23.38,24.62 v23.25,24.5
  Bottom 0.203: v21.5,20.75 21.5,22.75 v23.25,24.5
N$14  (via drill 0.4)
  Top 0.203: R15.2 37.2,15.65 C14.1 36.9,15.85 35.75,17 32.5,17 32,17.5 29,17.5 27.25,19.25 22.75,19.25 22.25,19.75 22.25,21 | 22.25,21 21.5,21.75 11.75,21.75 8.75,24.75 4.75,24.75 4,25.5 4,35.5 4.5,36 5.73,36 H8.4 | 22.25,21 v22.25,21.75 | v23.75,23.5 24,23.5 24.12,23.38 25.35,23.38 U1.12
  Bottom 0.203: v22.25,21.75 22.25,22 v23.75,23.5
N$19  (via drill 0.4)
  Top 0.203: v43.75,15.25 43.35,15.65 R16.2 42.8,15.85 C15.1 40.52,15.85 39.38,17 36.38,17 35.88,17.5 32.62,17.5 32.12,18 29.12,18 27.5,19.62 23.25,19.62 23,19.88 23,21.88 22.5,22.38 12.38,22.38 9.5,25.25 9.5,30.23 H8.5 | v51.38,23.38 49.65,23.38 U2.3
  Bottom 0.203: v43.75,15.25 43.75,13.25 44.12,12.88 51.5,12.88 52.12,13.5 52.12,22.62 v51.38,23.38
N$20  (via drill 0.4)
  Top 0.203: C16.1 46.8,15.85 R17.2 | C16.1 47.35,15.85 v47.5,16 | U2.5 49.65,24.62 51,24.62 51.62,24 52,24 52.25,23.75 52.25,23.25 51.5,22.5 v51.5,21.88 | C16.1 45,15.88 43.88,17 40.5,17 39.88,17.62 36.5,17.62 35.88,18.25 32.62,18.25 32.12,18.75 29.12,18.75 27.75,20.12 23.88,20.12 23.5,20.5 23.5,22.12 22.62,23 13,23 11,25 11,30.5 v10.25,31.25
  Bottom 0.203: v47.5,16 51.38,16 51.5,16.12 v51.5,21.88 | v10.25,31.25 6.06,31.25 H8.6
N$21  (via drill 0.4)
  Top 0.203: R18.2 49.2,15.65 C17.1 49,16.75 44,21.75 44,24.12 43.5,24.62 42.4,24.62 U2.10 42.33,24.7 40.5,24.7 38.95,26.25 34,26.25 33.5,26.75 23.88,26.75 20.88,23.75 14,23.75 12.5,25.25 12.5,28.25 v12.25,28.5
  Bottom 0.203: v12.25,28.5 6.15,28.5 H8.7

### Text on the board
tNames: CH9_CV | CH10_CV | CH11_CV | CH12_CV | CH13_CV | CH14_CV | CH15_CV | NC | +12V_REG | 5V | 3.3V | DGND | DGND | DGND | v2.0
_tNames: R1 | R74 | T2 | R2 | R75 | R3 | T1 | C1 | C2 | R4 | R5 | C4 | R7 | R6 | C12 | R8 | R9 | C13 | TP_SER | H1 | CH9_CV | CH10_CV | CH11_CV | H2 | CH12_CV | R52 | R53 | C23 | C24 | R54 | C25 | R10 | C5 | CH13_CV | CH14_CV | R55 | R56 | R57 | R11 | C3 | C6 | TP_15 | C7 | C8 | CH15_CV | NC | TP_14 | TP_11 | H8 | TP_10 | U1 | U2 | U3 | C27 | TP_9 | TP_12 | TP_13 | C9 | C10 | C11 | C14 | C15 | C16 | C17 | +12V_REG | C26 | U4 | R12 | R13 | R14 | R15 | R16 | R17 | R18 | C29 | 5V | 3.3V | C28 | DGND | DGND | DGND | H9 | v2.0